# Altium schematic sheet RF_Receive.SchDoc
size A4; DocumentNumber: 27; SheetNumber: 27; SheetTotal: 47
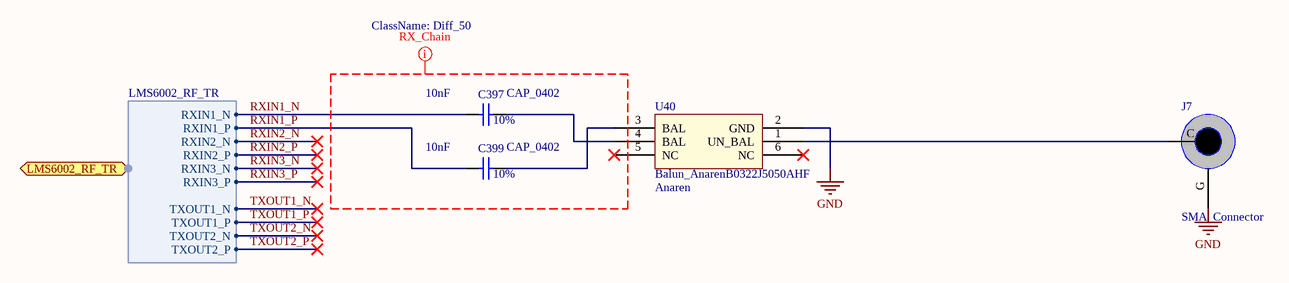
[diagram p0: RF_Receive.SchDoc]

## Parts
C397  CAP_0402  value 10nF  Tolerance: 10%  [CAPC0402(1005)60_N]
C399  CAP_0402  value 10nF  Tolerance: 10%  [CAPC0402(1005)60_N]
J7  SMA_Connector  [Connector_SMA_Amphenol_132255_Edgemount]
U40  Balun_AnarenB0322J5050AHF  Manufacturer: Anaren  [Balun_AnarenB0322J5050AHF_6-PIN_SMD]

## Ports
LMS6002_RF_TR (harness LMS6002_RF_TR)

## Harnesses
LMS6002_RF_TR: RXIN1_N, RXIN1_P, RXIN2_N, RXIN2_P, RXIN3_N, RXIN3_P, TXOUT1_N, TXOUT1_P, TXOUT2_N, TXOUT2_P

## Nets
GND: J7.G U40.2(GND)
RXIN1_N: C397.1 ; port LMS6002_RF_TR.RXIN1_N
RXIN1_P: C399.1 ; port LMS6002_RF_TR.RXIN1_P
RXIN2_N: port LMS6002_RF_TR.RXIN2_N
RXIN2_P: port LMS6002_RF_TR.RXIN2_P
RXIN3_N: port LMS6002_RF_TR.RXIN3_N
RXIN3_P: port LMS6002_RF_TR.RXIN3_P
TXOUT1_N: port LMS6002_RF_TR.TXOUT1_N
TXOUT1_P: port LMS6002_RF_TR.TXOUT1_P
TXOUT2_N: port LMS6002_RF_TR.TXOUT2_N
TXOUT2_P: port LMS6002_RF_TR.TXOUT2_P
NetC397_2: C397.2 U40.4(BAL)
NetC399_2: C399.2 U40.3(BAL)
NetJ7_C: J7.C U40.1(UN_BAL)

Not connected (* = marked no-connect by the designer): U40 5(NC)* 6(NC)*

## Layout directives
net class Diff_50: (no net found under the mark)

## Library data of the parts
C397 C399 = ATC520L-103KT16T: CAP 10nF, 16V, 10%, EIA 0402; Manufacturer: ATC; Part Number: ATC520L-103KT16T; Footprint Ref: CAPC0402(1005)60_N; Library Ref: CAP_0402
J7 = 132255: CONN RCPT SMA END LAUNCH PCB; Part Number: 132255; Manufacturer: Amphenol Connex
U40 = B0322J5050AHF: Ultra Low Profile 0805 Balun, 50 ohm unbalanced to 50  Balanced; Part Number: B0322J5050AHF; Footprint Ref: Balun_AnarenB0322J5050AHF_6-PIN_SMD; Library Ref: Balun_AnarenB0322J5050AHF